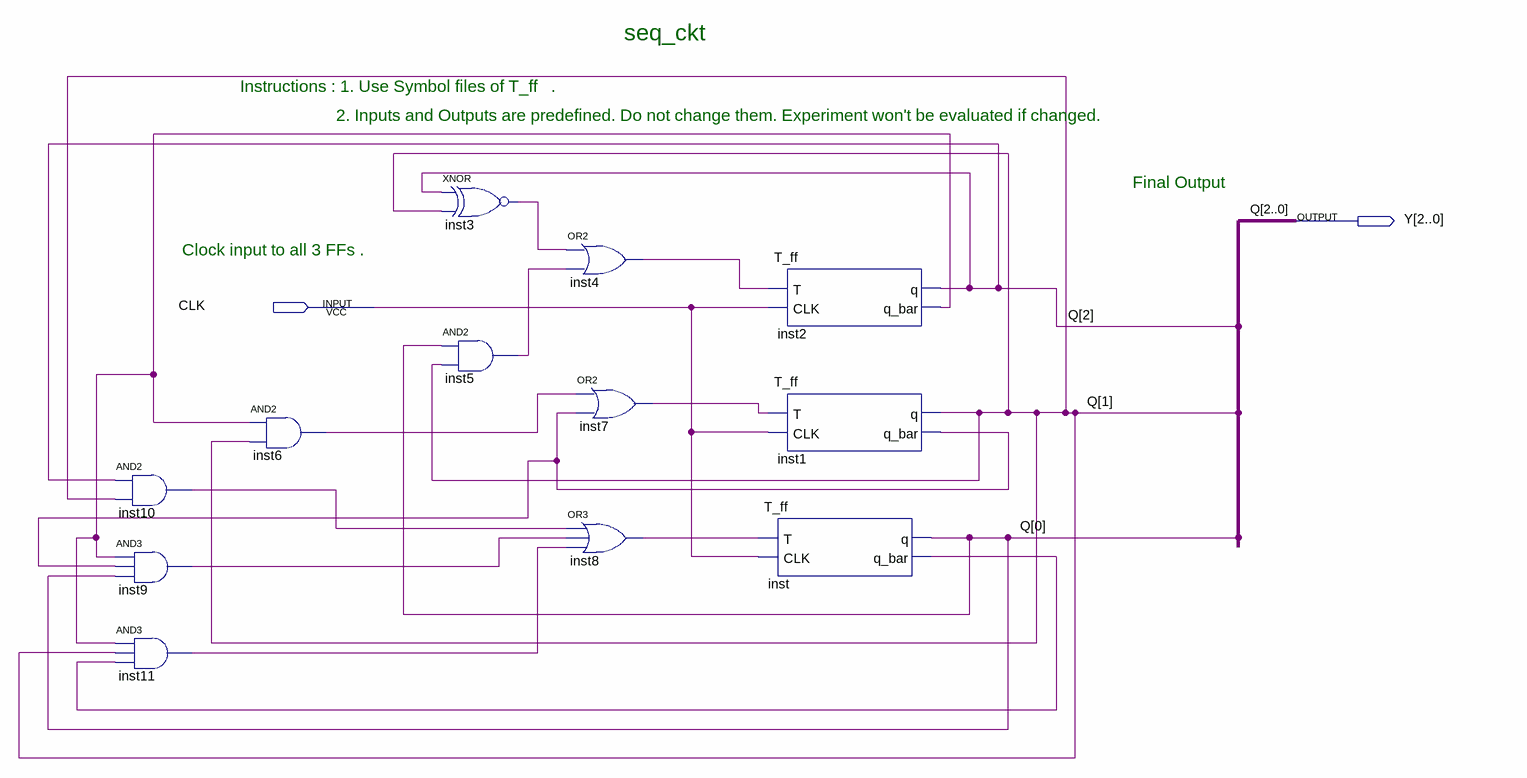
[diagram p0: schematic sheet]
// Quartus schematic seq_block.bdf as structural Verilog: 12 symbols, 2 pins
module seq_block (
  input  CLK,
  output [2:0] Y
);

  wire inst1_q_bar, inst2_q_bar, inst3_out, inst4_out, inst5_out, inst6_out, inst7_out, inst8_out, inst9_out,
       inst10_out, inst11_out, inst_q_bar;

  and inst10 (inst10_out, Y[2], Y[1]);
  and inst9 (inst9_out, inst2_q_bar, inst1_q_bar, Y[0]);
  and inst11 (inst11_out, inst2_q_bar, Y[1], inst_q_bar);
  and inst6 (inst6_out, inst2_q_bar, Y[1]);
  xnor inst3 (inst3_out, Y[2], Y[1]);
  and inst5 (inst5_out, Y[0], Y[1]);
  or inst4 (inst4_out, inst3_out, inst5_out);
  or inst7 (inst7_out, inst6_out, inst1_q_bar);
  or inst8 (inst8_out, inst10_out, inst9_out, inst11_out);
  T_ff inst2 (.T(inst4_out), .CLK(CLK), .q(Y[2]), .q_bar(inst2_q_bar));
  T_ff inst1 (.T(inst7_out), .CLK(CLK), .q(Y[1]), .q_bar(inst1_q_bar));
  T_ff inst (.T(inst8_out), .CLK(CLK), .q(Y[0]), .q_bar(inst_q_bar));

  // Other names for the same wires on the sheet: Q[2:0] = Y

  // Notes on the sheet:
  //   seq_ckt
  //   Instructions : 1. Use Symbol files of T_ff   . 
  //   2. Inputs and Outputs are predefined. Do not change them. Experiment won't be evaluated if changed.
  //   Final Output
  //   Clock input to all 3 FFs .
endmodule
